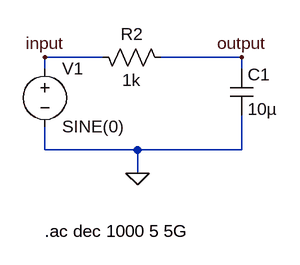
[diagram p0: schematic tutorial.asc]
tutorial.asc, the LTspice schematic file:
Version 4
SHEET 1 880 680
WIRE 400 288 320 288
WIRE 592 288 480 288
WIRE 320 304 320 288
WIRE 592 304 592 288
WIRE 320 416 320 384
WIRE 448 416 320 416
WIRE 592 416 592 368
WIRE 592 416 448 416
WIRE 448 448 448 416
FLAG 448 448 0
FLAG 592 288 output
FLAG 320 288 input
SYMBOL res 496 304 M270
WINDOW 0 32 56 VTop 2
WINDOW 3 0 56 VBottom 2
SYMATTR InstName R2
SYMATTR Value 1k
SYMBOL voltage 320 288 R0
SYMATTR InstName V1
SYMATTR Value SINE(0)
SYMATTR Value2 AC 1
SYMBOL cap 576 304 R0
SYMATTR InstName C1
SYMATTR Value 10µ
TEXT 320 528 Left 2 !.ac dec 1000 5 5G

The netlist it stands for:
* tutorial.asc
R2 output input 1k
V1 input 0 SINE(0) AC 1
C1 output 0 10µ
.ac dec 1000 5 5G
.backanno
.end